# Altium schematic sheet hdmi.SchDoc
size A4; SheetNumber: 2; SheetTotal: 2
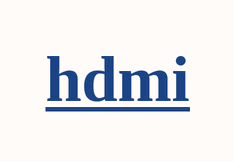
[diagram p0: hdmi.SchDoc]

## Notes on the sheet
- hdmi